# EAGLE design ADC + DAC (EAGLE 6.3)
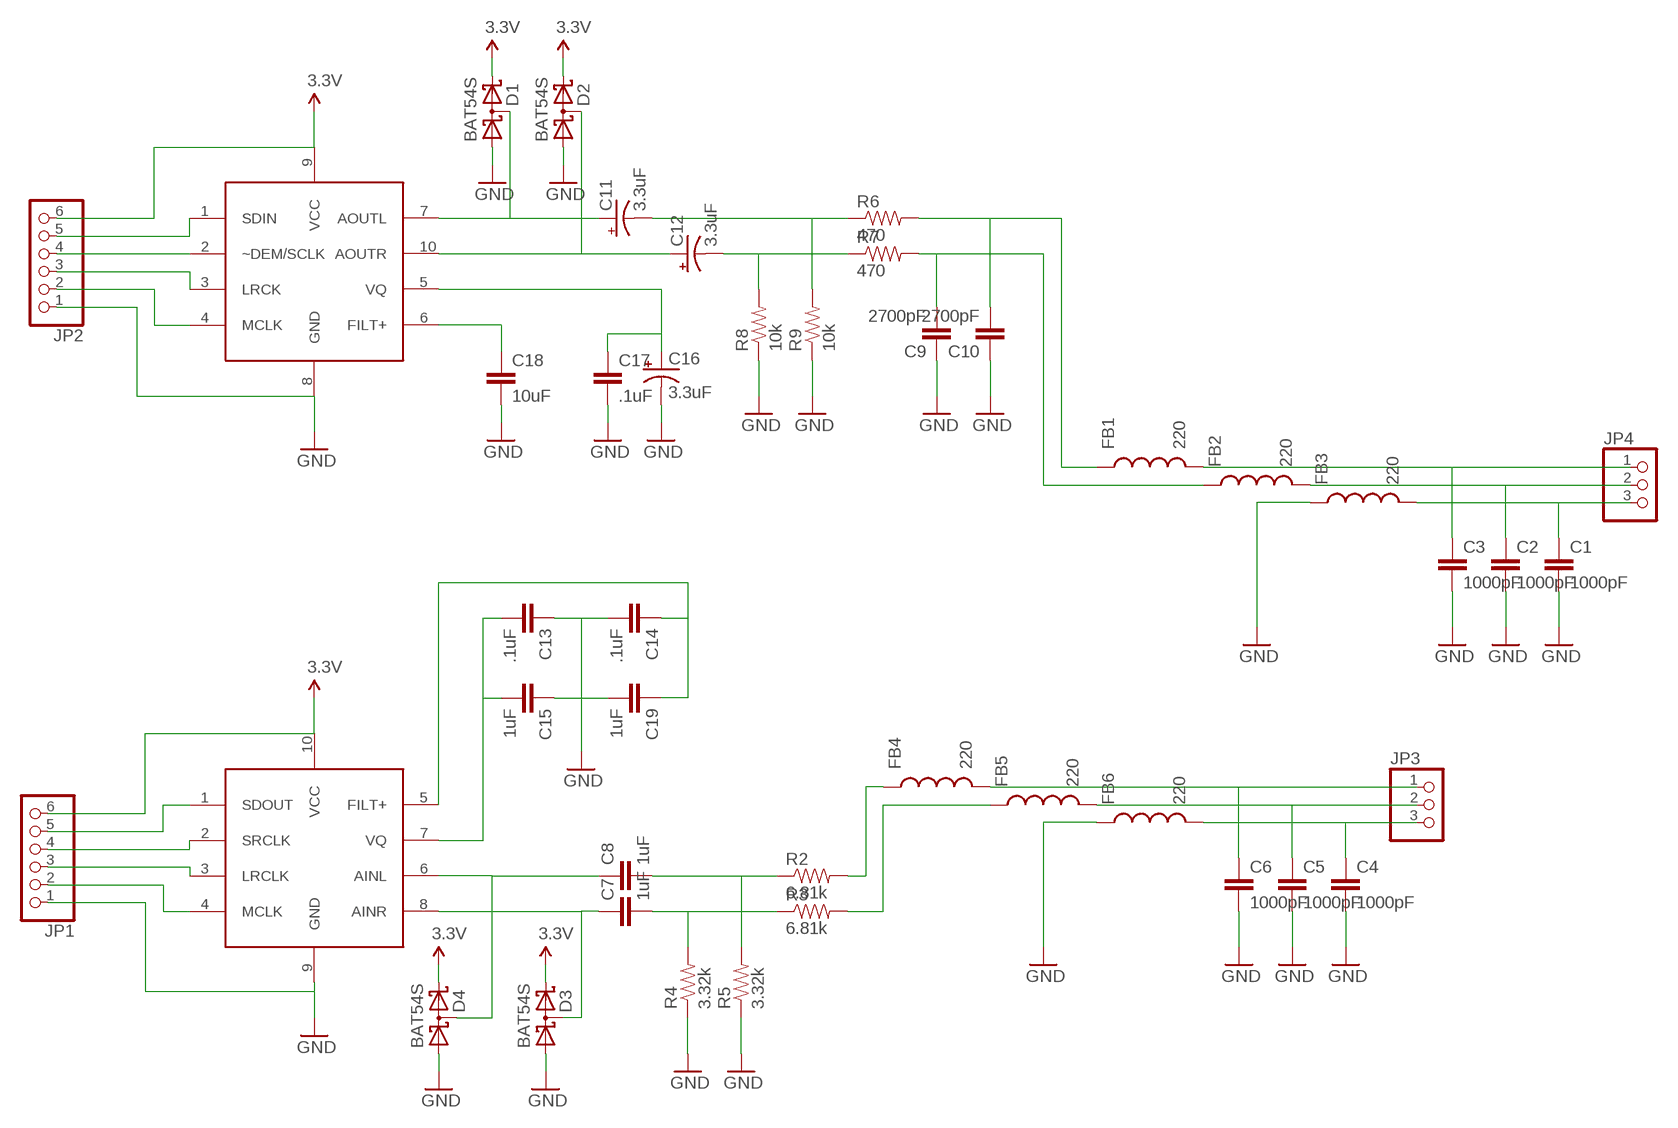
[diagram p0: schematic, sheet 1]

## Parts
C1  1000pF  CAP0402-CAP  [0402-CAP]
C2  1000pF  CAP0402-CAP  [0402-CAP]
C3  1000pF  CAP0402-CAP  [0402-CAP]
C4  1000pF  CAP0402-CAP  [0402-CAP]
C5  1000pF  CAP0402-CAP  [0402-CAP]
C6  1000pF  CAP0402-CAP  [0402-CAP]
C7  1uF  CAP0402-CAP  [0402-CAP]
C8  1uF  CAP0402-CAP  [0402-CAP]
C9  2700pF  CAP0402-CAP  [0402-CAP]
C10  2700pF  CAP0402-CAP  [0402-CAP]
C11  3.3uF  CAP_POL1206  [EIA3216]
C12  3.3uF  CAP_POL1206  [EIA3216]
C13  .1uF  CAP0402-CAP  [0402-CAP]
C14  .1uF  CAP0402-CAP  [0402-CAP]
C15  1uF  CAP0402-CAP  [0402-CAP]
C16  3.3uF  CAP_POL1206  [EIA3216]
C17  .1uF  CAP0402-CAP  [0402-CAP]
C18  10uF  CAP0402-CAP  [0402-CAP]
C19  1uF  CAP0402-CAP  [0402-CAP]
D1  BAT54S  [SOT23]
D2  BAT54S  [SOT23]
D3  BAT54S  [SOT23]
D4  BAT54S  [SOT23]
FB1  220  INDUCTOR0805  [0805]
FB2  220  INDUCTOR0805  [0805]
FB3  220  INDUCTOR0805  [0805]
FB4  220  INDUCTOR0805  [0805]
FB5  220  INDUCTOR0805  [0805]
FB6  220  INDUCTOR0805  [0805]
JP1  PINHD-1X6  [1X06]
JP2  PINHD-1X6  [1X06]
JP3  PINHD-1X3  [1X03]
JP4  PINHD-1X3  [1X03]
R2  6.81k  RESISTOR0603-RES  [0603-RES]
R3  6.81k  RESISTOR0603-RES  [0603-RES]
R4  3.32k  RESISTOR0603-RES  [0603-RES]
R5  3.32k  RESISTOR0603-RES  [0603-RES]
R6  470  RESISTOR0603-RES  [0603-RES]
R7  470  RESISTOR0603-RES  [0603-RES]
R8  10k  RESISTOR0603-RES  [0603-RES]
R9  10k  RESISTOR0603-RES  [0603-RES]
U$2  CS4344-DAC  [TSSOP-10]
U$3  CS5343  [TSSOP-10]

## Nets
AIN_SLEEV: C4.1 FB6.2 JP3.3
AINL: C6.1 FB4.2 JP3.1
AINL_C: C8.1 D4.3(C1A2) U$3.6(AINL)
AINL_FB: FB4.1 R2.2
AINL_R: C8.2 R2.1 R5.2
AINR: C5.1 FB5.2 JP3.2
AINR_C: C7.1 D3.3(C1A2) U$3.8(AINR)
AINR_FB: FB5.1 R3.2
AINR_R: C7.2 R3.1 R4.2
AOUTL: C3.1 FB1.2 JP4.1
AOUTL_C: C11.A(+) D1.3(C1A2) U$2.7(AOUTL)
AOUTL_FB: C10.2 FB1.1 R6.2
AOUTL_R: C11.C(-) R6.1 R9.2
AOUTR: C2.1 FB2.2 JP4.2
AOUTR_C: C12.A(+) D2.3(C1A2) U$2.10(AOUTR)
AOUTR_FB: C9.2 FB2.1 R7.2
AOUTR_R: C12.C(-) R7.1 R8.2
AOUTS: C1.1 FB3.2 JP4.3
FILT+: C18.1 U$2.6(FILT+)
GND: C1.2 C2.2 C3.2 C4.2 C5.2 C6.2 C9.1 C10.1 C13.1 C14.2 C15.1 C16.C(-) C17.2 C18.2 C19.2 D1.1(A1) D2.1(A1) D3.1(A1) D4.1(A1) FB3.1 FB6.1 JP1.1 JP2.1 R4.1 R5.1 R8.1 R9.1 U$2.8(GND) U$3.9(GND)
LRCLK: JP2.3 U$2.3(LRCK)
MCLK: JP2.2 U$2.4(MCLK)
N$1: C13.2 C15.2 U$3.7(VQ)
N$5: JP1.2 U$3.4(MCLK)
N$6: C14.1 C19.1 U$3.5(FILT+)
N$7: JP1.3 U$3.3(LRCLK)
N$8: JP1.4 U$3.2(SRCLK)
N$9: JP1.5 U$3.1(SDOUT)
SCLK: JP2.4 U$2.2(~DEM/SCLK)
SDIN: JP2.5 U$2.1(SDIN)
VCC: D1.2(C2) D2.2(C2) D3.2(C2) D4.2(C2) JP1.6 JP2.6 U$2.9(VCC) U$3.10(VCC) ; supply symbol labelled 3.3V
VQ: C16.A(+) C17.1 U$2.5(VQ)

## Library data of the parts
C1-C10 C13-C15 C17-C19 = 1x05smd:CAP: Capacitor Standard 0603 ceramic capacitor, and 0.1" leaded capacitor.
C11 C12 C16 = 1x05smd:CAP_POL: Capacitor Polarized These are standard SMD and PTH capacitors. Normally 10uF, 47uF, and 100uF in electrolytic and tantalum varieties. Always verify the external diameter of the through hole cap, it varies with capacity, voltage, and manufacturer. The EIA devices should be standard.
D1-D4 = diode:BAT54S: Schottky Diodes Pin connection corrected 2011-05-04 Source: Fairchild .. BAT54.pdf
FB1-FB6 = SparkFun-Passives:INDUCTOR: Inductors Basic Inductor/Choke - 0603 and 1206. Footprints are not proven and vary greatly between part numbers.
JP1 JP2 = adafruit:PINHD-1X6: PIN HEADER
JP3 JP4 = adafruit:PINHD-1X3: PIN HEADER
R2-R9 = 1x05smd:RESISTOR: Resistor Basic schematic elements and footprints for 0603, 1206, and PTH 1/10th watt (small) resistors.
U$2 = Strutz Electronic Industries:CS4344-DAC
U$3 = Strutz Electronic Industries:CS5343

## Board
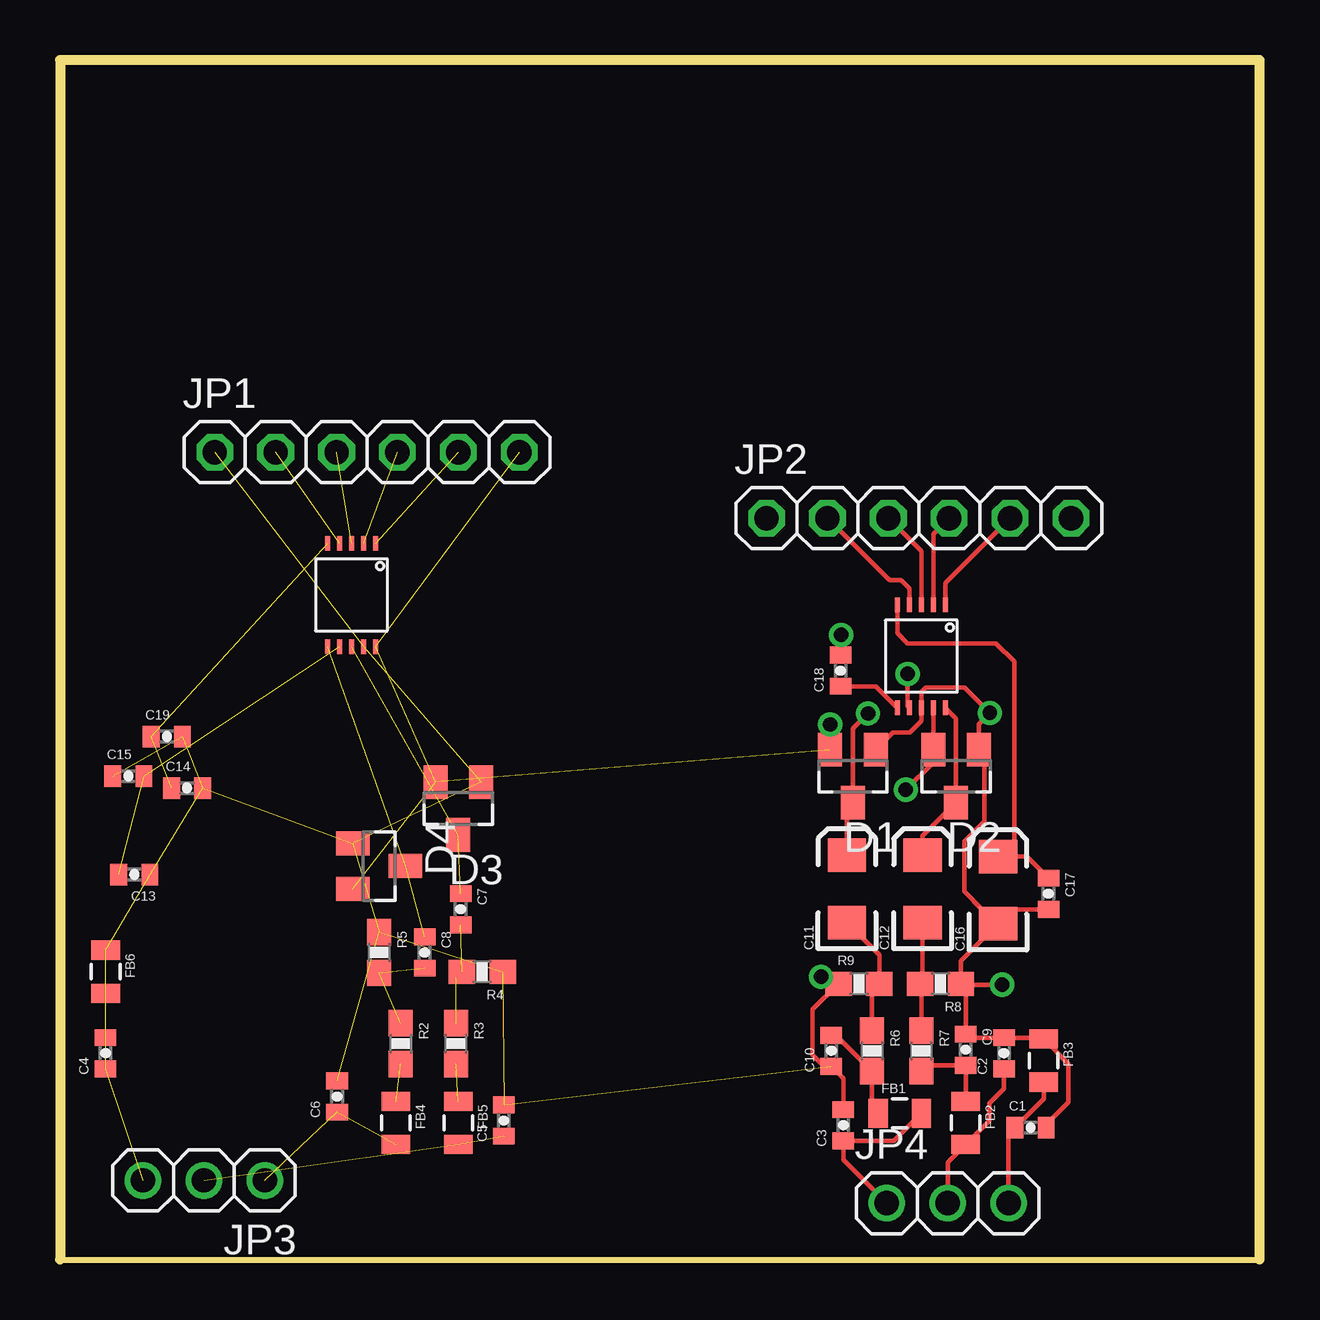
[diagram p1: board, top side]
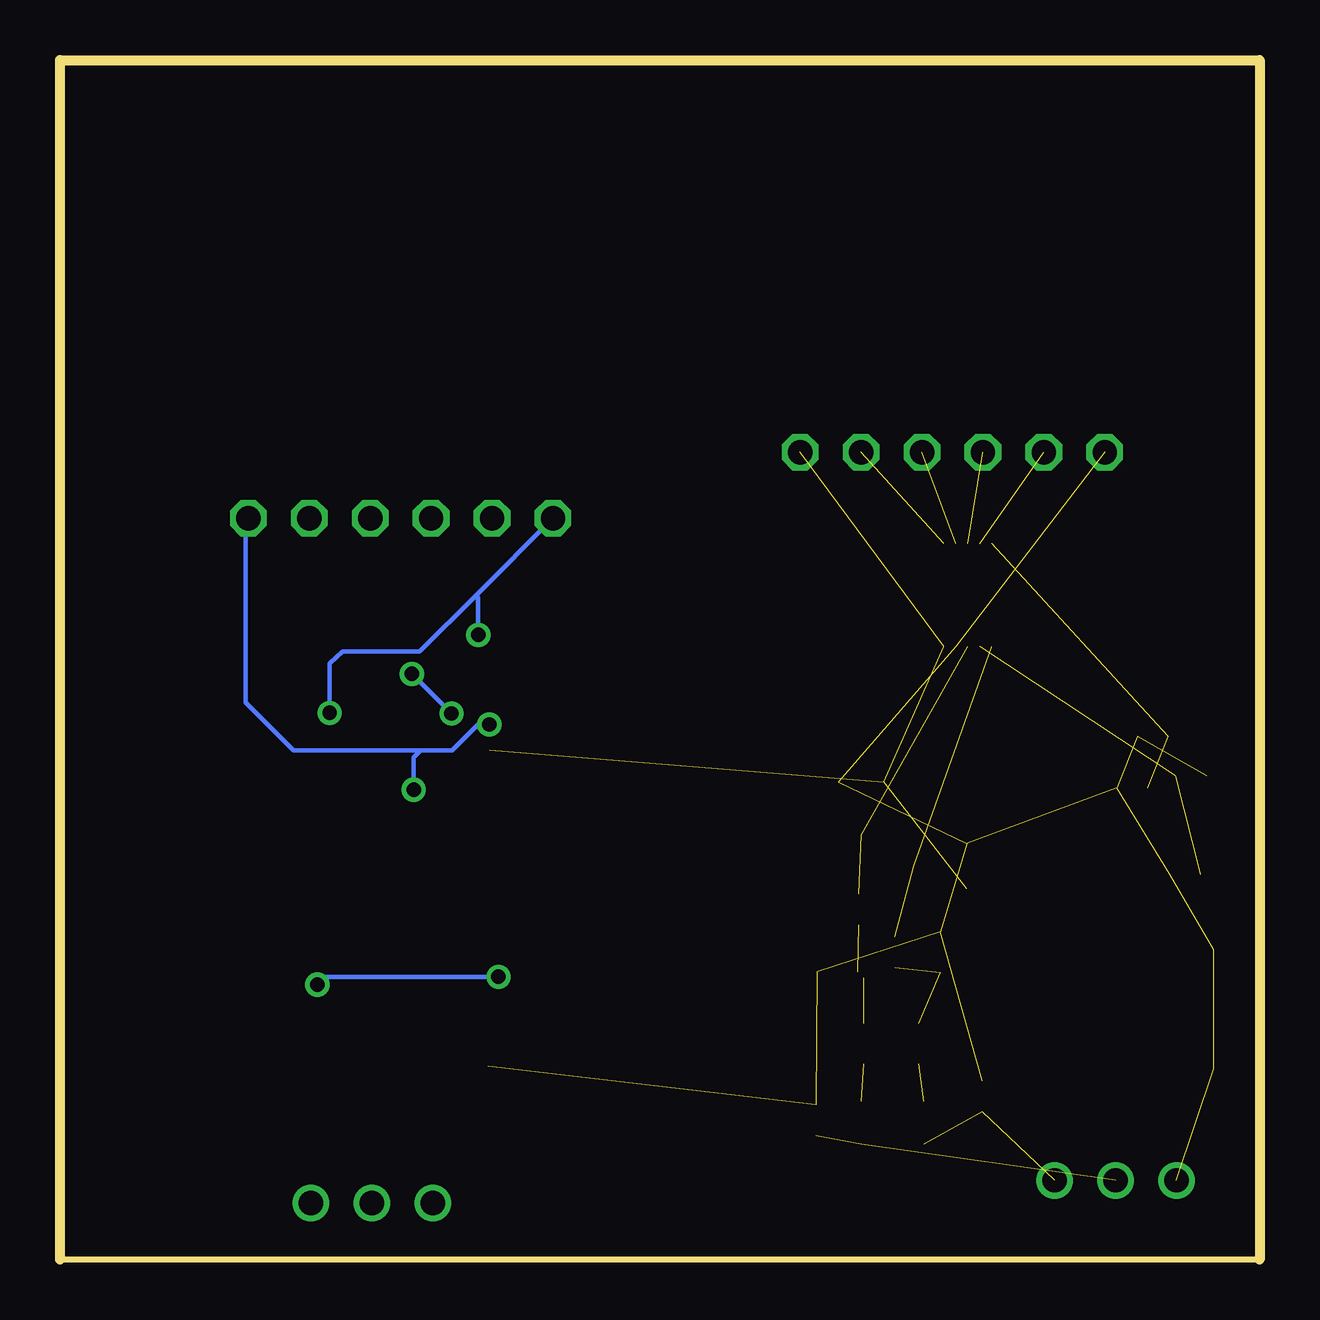
[diagram p2: board, bottom side, seen from below]

Size 50 x 50 mm. Coordinates in mm from the lower left corner, seen from the top.
Outline: 50,50 0,50 0,0 50,0 50,50
Copper layers (1*16): Top 0.035mm / dielectric 0.2mm / Bottom 0.035mm
Design rules "default *": minimum track width 10mil, minimum drill 24mil, track to track 8mil, track to pad 8mil, pad to pad 8mil, via to via 8mil, smd to smd 8mil, copper to edge 40mil, drill to drill 8mil, minimum pad ring 10mil, minimum via ring 8mil, stop-mask expansion 4mil, vias tented up to drill 0mil, thermal gap 10mil

### Footprints (pad centres in the part's own frame; a part is rotated, then mirrored left to right if it is on the bottom)
0402-CAP = smd 0.7 x 0.9: 1 -0.65,0; 2 0.65,0
EIA3216 = smd 1.4 x 1.6: A 1.4,0; C -1.4,0
SOT23 = smd 1 x 1.4: 1 -0.95,-1.1; 2 0.95,-1.1; 3 0,1.1
0805 = smd 0.8 x 1.2: 1 -0.9,0; 2 0.9,0
1X06 = drill 1.016 octagon: 1 -6.35,0; 2 -3.81,0; 3 -1.27,0; 4 1.27,0; 5 3.81,0; 6 6.35,0
1X03 = drill 1.016: 1 -2.54,0; 2 0,0; 3 2.54,0
0603-RES = smd 1.1 x 1: 1 -0.85,0; 2 0.85,0
TSSOP-10 = smd 0.6 x 0.2: 1 -2.15,1; 2 -2.15,0.5; 3 -2.15,0; 4 -2.15,-0.5; 5 -2.15,-1; 6 2.15,-1; 7 2.15,-0.5; 8 2.15,0; 9 2.15,0.5; 10 2.15,1

### Placement (x,y rotation side)
C1  40.45,5.5 0 top
C2  39.35,8.6 90 top
C3  32.65,5.6 90 top
C4  1.9,8.6 90 top
C5  18.5,5.8 90 top
C6  11.55,6.8 90 top
C7  16.7,14.6 270 top
C8  15.2,12.8 270 top
C9  37.75,8.75 270 top
C10  32.15,8.7 90 top
C11  32.8,15.45 90 top
C12  35.95,15.45 90 top
C13  3.1,16.05 180 top
C14  5.3,19.65 0 top
C15  2.85,20.15 0 top
C16  39.1,15.4 90 top
C17  41.2,15.25 270 top
C18  32.54,24.54 90 top
C19  4.45,21.8 0 top
D1  33.05,20.15 180 top
D2  37.35,20.15 180 top
D3  16.6,18.8 180 top
D4  13.3,16.4 270 top
FB1  35,6.1 0 top
FB2  37.75,5.7 270 top
FB3  41,8.3 270 top
FB4  14,5.7 270 top
FB5  16.6,5.7 270 top
FB6  1.9,12 270 top
JP1  12.8,33.65 0 top
JP2  35.8,30.9 0 top
JP3  6,3.3 180 top
JP4  37,2.35 0 top
R2  14.2,9 270 top
R3  16.5,9 270 top
R4  17.6,12 180 top
R5  13.3,12.8 270 top
R6  33.85,8.7 270 top
R7  35.9,8.7 270 top
R8  36.7,11.5 180 top
R9  33.3,11.5 0 top
U$2  35.9,25.15 270 top
U$3  12.15,27.7 270 top

### Tracks (layer width: path | path; a pad name or v marks a point on that pad's centre or on a via)
AIN_SLEEV  (2 unrouted)
AINL  (2 unrouted)
AINL_C  (2 unrouted)
AINL_FB  (1 unrouted)
AINL_R  (2 unrouted)
AINR  (2 unrouted)
AINR_C  (2 unrouted)
AINR_FB  (1 unrouted)
AINR_R  (2 unrouted)
  Top 0.254: 16.5,11.75 R4.2
AOUTL
  Top 0.178: FB1.2 34.75,4.95 C3.1 32.65,4.16 JP4.1
AOUTL_C  (via drill 0.6)
  Top 0.178: v33.68,22.76 33.05,22.13 D1.3 32.8,18.8 C11.A | v35.33,24.41 35.33,23.07 U$2.7
  Bottom 0.178: v33.68,22.76 v35.33,24.41
AOUTL_FB
  Top 0.178: C10.2 32.35,9.35 R6.2 33.85,6.35 FB1.1
AOUTL_R
  Top 0.178: C11.C 34.15,12.7 R9.2 33.85,11.2 R6.1
AOUTR
  Top 0.178: JP4.2 37,4.05 FB2.2 38.73,5.79 38.73,6.5 39.35,7.12 C2.1
AOUTR_C
  Top 0.178: U$2.10 37.35,22.55 D2.3 35.95,17.65 C12.A
AOUTR_FB
  Top 0.178: FB2.1 C9.2 36.15,8.1 R7.2
AOUTR_R
  Top 0.178: C12.C 35.95,11.6 R8.2 35.9,11.45 R7.1
AOUTS
  Top 0.178: JP4.3 39.54,5.24 C1.1 41,6.7 FB3.2
FILT+
  Top 0.178: C18.1 34.01,23.89 U$2.6
GND  (via drill 0.6)  (14 unrouted)
  Top 0.178: C17.2 39.7,14.6 | 39.7,14.6 C16.C 37.55,12.45 R8.1 | R8.1 37.75,11.3 C9.1 37.9,9.25 C2.2 40.95,9.25 FB3.1 42.04,8.16 42.04,6.55 41.1,5.62 C1.2 | D1.1 34.72,21.97 35.43,21.97 35.9,22.44 U$2.8 35.9,23.66 36.09,23.85 37.69,23.85 v38.76,22.78 38.3,22.32 D2.1 38.53,21.02 38.53,18.26 37.69,17.42 37.69,15.34 38.44,14.6 39.7,14.6 | C18.2 32.54,26.01 v32.56,26.04 | C3.2 32.65,7.55 C10.1 31.85,8.05 31.37,8.53 31.37,10.42 R9.1 32.01,11.5 v31.73,11.79 | v39.27,11.46 37.59,11.46 R8.1
  Bottom 0.178: v38.76,22.78 38.76,24.84 38.23,25.35 35,25.35 32.66,27.69 | 32.66,27.69 JP2.1 | v32.56,26.04 32.56,27.58 32.66,27.69 | v31.73,11.79 38.94,11.79 v39.27,11.46
LRCLK
  Top 0.178: U$2.3 35.9,29.53 JP2.3
MCLK
  Top 0.178: U$2.4 35.4,27.97 35.05,28.32 34.57,28.32 JP2.2
N$1  (2 unrouted)
N$5  (1 unrouted)
N$6  (2 unrouted)
N$7  (1 unrouted)
N$8  (1 unrouted)
N$9  (1 unrouted)
SCLK
  Top 0.178: U$2.2 36.4,30.23 JP2.4
SDIN
  Top 0.178: U$2.1 36.9,28.19 JP2.5
VCC  (via drill 0.6)  (4 unrouted)
  Top 0.178: U$2.9 D2.2 36.4,20.73 v35.26,19.58 | D1.2 v32.1,22.3 v32.11,22.3
  Bottom 0.178: v32.11,22.3 32.56,22.3 33.66,21.21 34.98,21.21 | 34.98,21.21 40.26,21.21 42.27,23.22 42.27,30.78 JP2.6 | v35.26,19.58 35.26,20.93 34.98,21.21
VQ
  Top 0.178: C16.A 39.8,16.8 | 39.8,16.8 40.3,16.8 C17.1 | U$2.5 34.9,26.11 35.33,25.68 39.01,25.68 39.78,24.92 39.78,16.82 39.8,16.8